# Altium schematic sheet 780-00055, rev2, Pg1, SCH, NRES Temp Meas, 8-Chan RTD .SchDoc
size B; PageSetup: Record=PageOptions|CenterHorizontal=True|CenterVertical=True|PrintScale=1.00|XCorrection=1.00|YCorrection=1.00|PrintKind=0|BorderSize=5000000|LeftOffset=0|BottomOffset=0|Orientation=2|PaperLength=4318|PaperWidth=2794|Scale=100|PaperSource=7|PrintQuality=600|MediaType=257|DitherType=256|PrintScaleMode=0|PaperKind=Ledger|PaperIndex=3
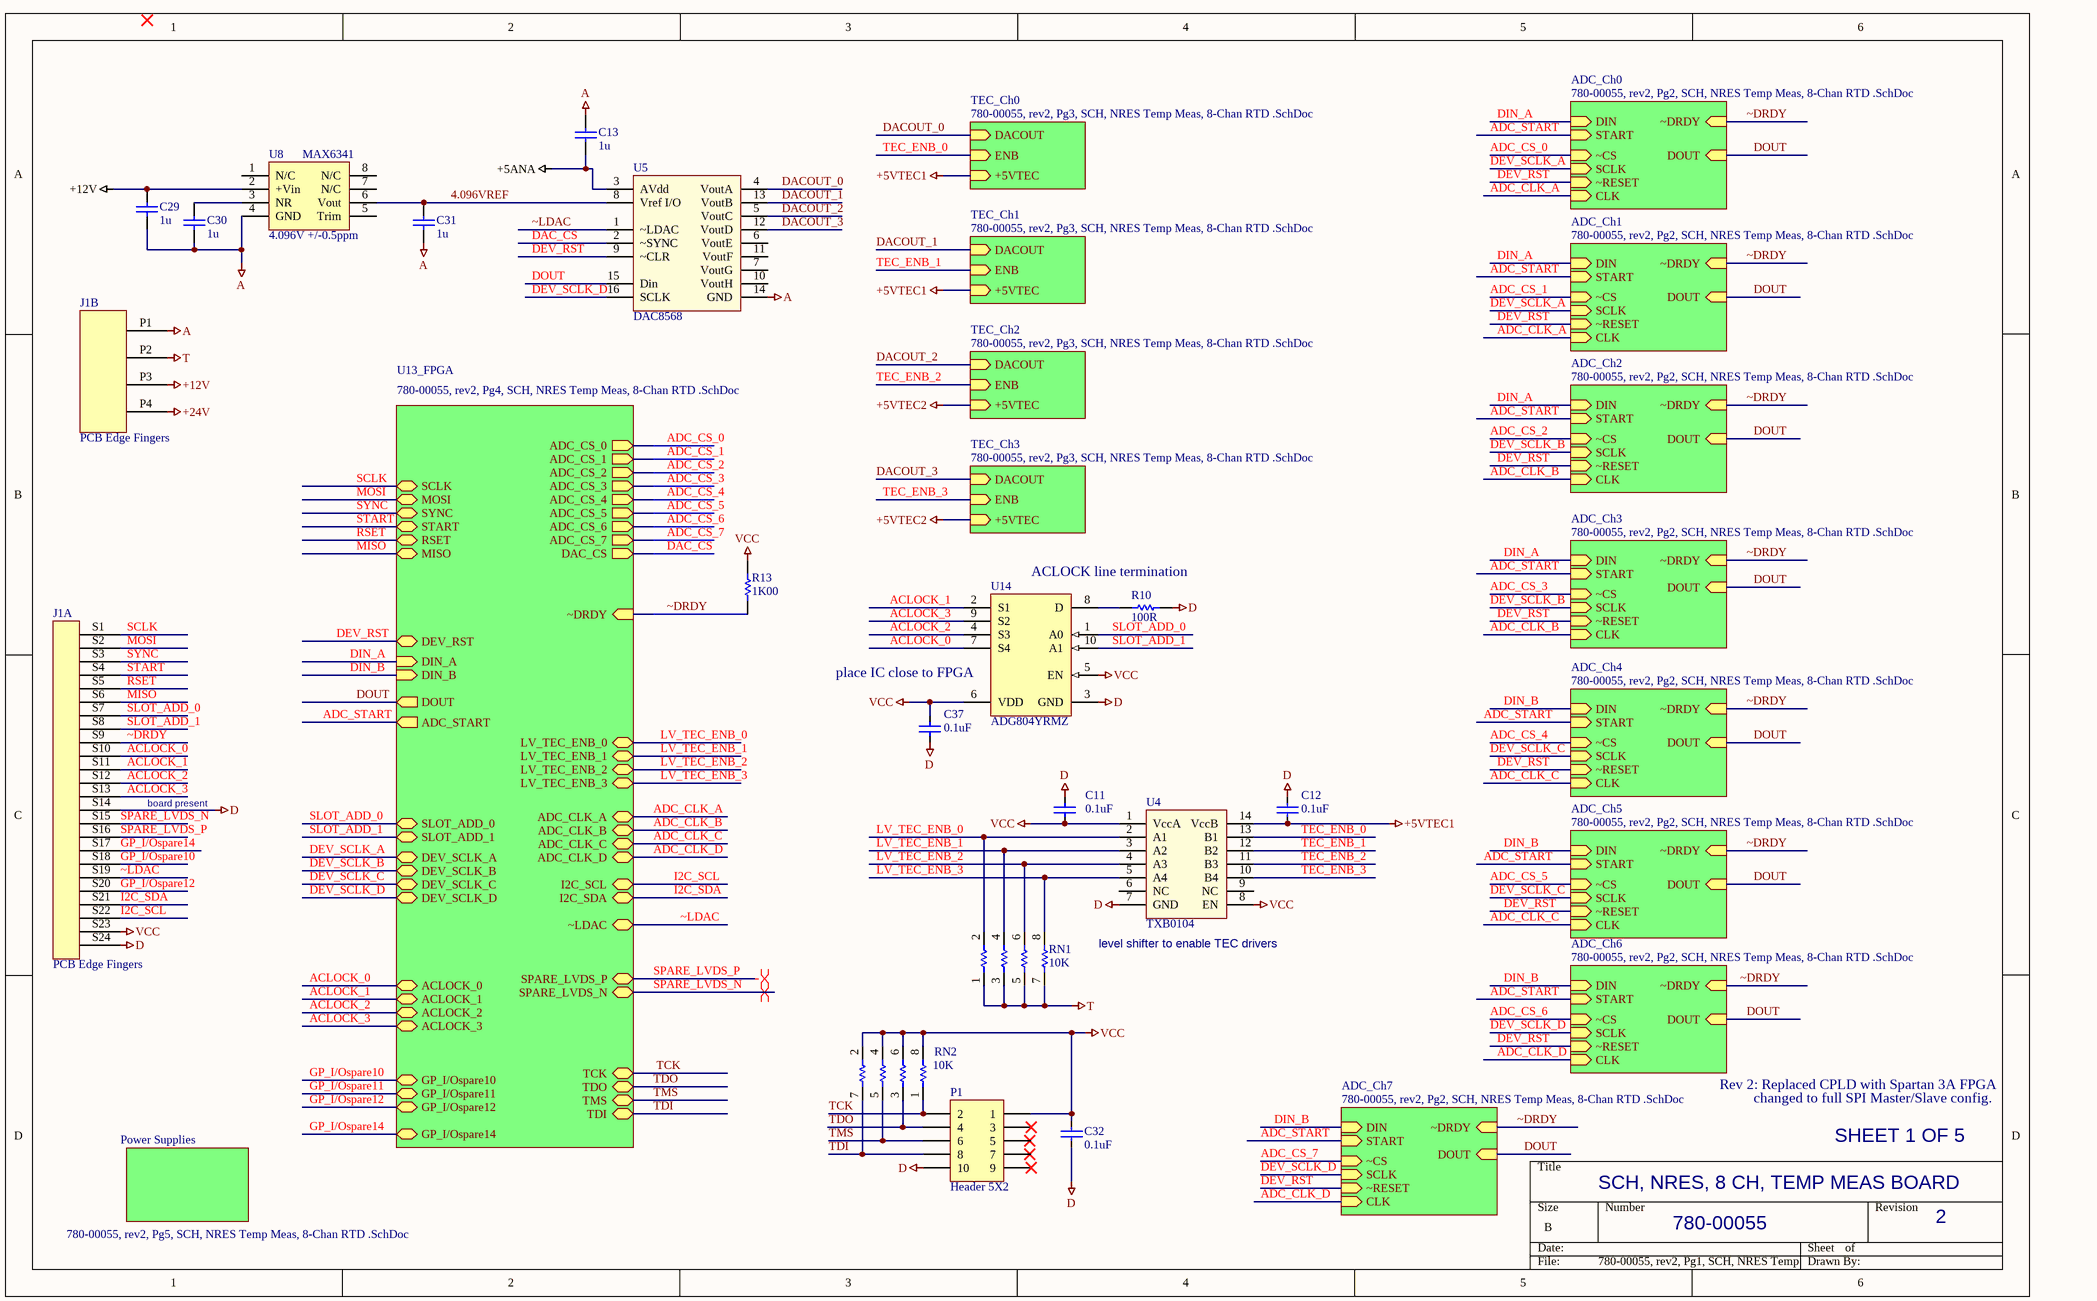
[diagram p0: 780-00055, rev2, Pg1, SCH, NRES Temp Meas, 8-Chan RTD .SchDoc]

## Parts
C11  value 0.1uF  [SMD_0805]  (hidden comment: Cap SMD)
C12  value 0.1uF  [SMD_0805]  (hidden comment: Cap SMD)
C13  1u  [SMD_0805]
C29  1u  [SMD_0805]
C30  1u  [SMD_0805]
C31  1u  [SMD_0805]
C32  value 0.1uF  [SMD_0805]  (hidden comment: Cap SMD)
C37  value 0.1uF  [SMD_0805]  (hidden comment: Cap SMD)
J1  PCB Edge Fingers  [PCB EDGE, MOLEX 46114]  (parts A,B of 2)
P1  Header 5X2  [HDR 2x5 RT, SAMTEC TSW]
R10  value 100R  [SMD_0805]  (hidden comment: Res 0805)
R13  value 1K00  [SMD_0805]  (hidden comment: Res 0805)
RN1  value 10K  [RES ARRAY 0603 x 4]  (hidden comment: RES ARRAY  x4 10K)
RN2  value 10K  [RES ARRAY 0603 x 4]  (hidden comment: RES ARRAY  x4)
U4  TXB0104  [TSSOP14]
U5  DAC8568  [TSSOP16]
U8  4.096V +/-0.5ppm  value MAX6341  [SO-8_M]
U14  ADG804YRMZ  [ADI-RM-10_L]

## Sub-sheets
ADC_Ch0 = 780-00055, rev2, Pg2, SCH, NRES Temp Meas, 8-Chan RTD .SchDoc: SCLK (in), ~RESET (in), DIN (in), ~DRDY (in), DOUT (in), ~CS (in), START (in), CLK (in)
ADC_Ch1 = 780-00055, rev2, Pg2, SCH, NRES Temp Meas, 8-Chan RTD .SchDoc: SCLK (in), ~RESET (in), DIN (in), ~DRDY (in), ~CS (in), DOUT (in), START (in), CLK (in)
ADC_Ch2 = 780-00055, rev2, Pg2, SCH, NRES Temp Meas, 8-Chan RTD .SchDoc: SCLK (in), ~RESET (in), DIN (in), ~DRDY (in), ~CS (in), DOUT (in), START (in), CLK (in)
ADC_Ch3 = 780-00055, rev2, Pg2, SCH, NRES Temp Meas, 8-Chan RTD .SchDoc: SCLK (in), ~RESET (in), DIN (in), ~DRDY (in), ~CS (in), DOUT (in), START (in), CLK (in)
ADC_Ch4 = 780-00055, rev2, Pg2, SCH, NRES Temp Meas, 8-Chan RTD .SchDoc: SCLK (in), ~RESET (in), DIN (in), ~DRDY (in), ~CS (in), DOUT (in), START (in), CLK (in)
ADC_Ch5 = 780-00055, rev2, Pg2, SCH, NRES Temp Meas, 8-Chan RTD .SchDoc: SCLK (in), ~RESET (in), DIN (in), ~DRDY (in), ~CS (in), DOUT (in), START (in), CLK (in)
ADC_Ch6 = 780-00055, rev2, Pg2, SCH, NRES Temp Meas, 8-Chan RTD .SchDoc: SCLK (in), ~RESET (in), DIN (in), ~DRDY (in), ~CS (in), DOUT (in), START (in), CLK (in)
ADC_Ch7 = 780-00055, rev2, Pg2, SCH, NRES Temp Meas, 8-Chan RTD .SchDoc: SCLK (in), ~RESET (in), DIN (in), ~DRDY (in), ~CS (in), DOUT (in), START (in), CLK (in)
Power Supplies = 780-00055, rev2, Pg5, SCH, NRES Temp Meas, 8-Chan RTD .SchDoc: no entries
TEC_Ch0 = 780-00055, rev2, Pg3, SCH, NRES Temp Meas, 8-Chan RTD .SchDoc: DACOUT (in), +5VTEC (in), ENB (in)
TEC_Ch1 = 780-00055, rev2, Pg3, SCH, NRES Temp Meas, 8-Chan RTD .SchDoc: DACOUT (in), +5VTEC (in), ENB (in)
TEC_Ch2 = 780-00055, rev2, Pg3, SCH, NRES Temp Meas, 8-Chan RTD .SchDoc: DACOUT (in), +5VTEC (in), ENB (in)
TEC_Ch3 = 780-00055, rev2, Pg3, SCH, NRES Temp Meas, 8-Chan RTD .SchDoc: DACOUT (in), +5VTEC (in), ENB (in)
U13_FPGA = 780-00055, rev2, Pg4, SCH, NRES Temp Meas, 8-Chan RTD .SchDoc: ADC_CS_0 (out), ADC_CS_1 (out), ADC_CS_2 (out), ADC_CS_3 (out), ADC_CS_4 (out), ADC_CS_5 (out), ADC_CS_6 (out), ADC_CS_7 (out), DAC_CS (out), ADC_START (out), SCLK, MOSI, SYNC, START, RSET, MISO, SLOT_ADD_0, SLOT_ADD_1, DEV_SCLK_A, DEV_SCLK_B, DEV_SCLK_C, DEV_SCLK_D, DEV_RST, DIN_A (in), DIN_B (in), I2C_SCL, I2C_SDA, ~LDAC, GP_I/Ospare10, GP_I/Ospare11, GP_I/Ospare12, GP_I/Ospare14, ~DRDY (in), DOUT (out), ACLOCK_0, ACLOCK_1, ACLOCK_2, ACLOCK_3, ADC_CLK_A, ADC_CLK_B, ADC_CLK_C, ADC_CLK_D, LV_TEC_ENB_0, LV_TEC_ENB_1, LV_TEC_ENB_2, LV_TEC_ENB_3, TDI, TDO, TCK, TMS, SPARE_LVDS_P, SPARE_LVDS_N

## Nets
+5ANA: C13.2 U5.3(AVdd)
+5VTEC1: C12.1 U4.14(VccB) ; sheet TEC_Ch0/+5VTEC, sheet TEC_Ch1/+5VTEC
+5VTEC2: sheet TEC_Ch2/+5VTEC, sheet TEC_Ch3/+5VTEC
+12V: C29.1 J1.P3(S27) U8.2(+Vin)
+24V: J1.P4(S28)
A: C13.1 C29.2 C30.2 C31.2 J1.P1(S25) U5.14(GND) U8.4(GND)
D: C11.2 C12.2 C32.1 C37.1 J1.S14 J1.S24 P1.10 R10.2 U4.7(GND) U14.3(GND)
T: J1.P2(S26) RN1.1 RN1.3 RN1.5 RN1.7
VCC: C11.1 C32.2 C37.2 J1.S23 P1.1 R13.2 RN2.2 RN2.4 RN2.6 RN2.8 U4.1(VccA) U4.8(EN) U14.5(EN) U14.6(VDD)
4.096VREF: C31.1 U5.8(Vref_I/O) U8.6(Vout)
ACLOCK_0: J1.S10 U14.7(S4) ; sheet U13_FPGA/ACLOCK_0
ACLOCK_1: J1.S11 U14.2(S1) ; sheet U13_FPGA/ACLOCK_1
ACLOCK_2: J1.S12 U14.4(S3) ; sheet U13_FPGA/ACLOCK_2
ACLOCK_3: J1.S13 U14.9(S2) ; sheet U13_FPGA/ACLOCK_3
ADC_CLK_A: sheet ADC_Ch0/CLK, sheet ADC_Ch1/CLK, sheet U13_FPGA/ADC_CLK_A
ADC_CLK_B: sheet ADC_Ch3/CLK, sheet ADC_Ch2/CLK, sheet U13_FPGA/ADC_CLK_B
ADC_CLK_C: sheet ADC_Ch4/CLK, sheet ADC_Ch5/CLK, sheet U13_FPGA/ADC_CLK_C
ADC_CLK_D: sheet ADC_Ch6/CLK, sheet ADC_Ch7/CLK, sheet U13_FPGA/ADC_CLK_D
ADC_CS_0: sheet ADC_Ch0/~CS, sheet U13_FPGA/ADC_CS_0
ADC_CS_1: sheet ADC_Ch1/~CS, sheet U13_FPGA/ADC_CS_1
ADC_CS_2: sheet ADC_Ch2/~CS, sheet U13_FPGA/ADC_CS_2
ADC_CS_3: sheet ADC_Ch3/~CS, sheet U13_FPGA/ADC_CS_3
ADC_CS_4: sheet ADC_Ch4/~CS, sheet U13_FPGA/ADC_CS_4
ADC_CS_5: sheet ADC_Ch5/~CS, sheet U13_FPGA/ADC_CS_5
ADC_CS_6: sheet ADC_Ch6/~CS, sheet U13_FPGA/ADC_CS_6
ADC_CS_7: sheet ADC_Ch7/~CS, sheet U13_FPGA/ADC_CS_7
ADC_START: sheet ADC_Ch3/START, sheet ADC_Ch4/START, sheet ADC_Ch5/START, sheet ADC_Ch6/START, sheet ADC_Ch7/START, sheet ADC_Ch0/START, sheet ADC_Ch1/START, sheet ADC_Ch2/START, sheet U13_FPGA/ADC_START
DAC_CS: U5.2(~SYNC) ; sheet U13_FPGA/DAC_CS
DACOUT_0: U5.4(VoutA) ; sheet TEC_Ch0/DACOUT
DACOUT_1: U5.13(VoutB) ; sheet TEC_Ch1/DACOUT
DACOUT_2: U5.5(VoutC) ; sheet TEC_Ch2/DACOUT
DACOUT_3: U5.12(VoutD) ; sheet TEC_Ch3/DACOUT
DEV_RST: U5.9(~CLR) ; sheet ADC_Ch3/~RESET, sheet ADC_Ch4/~RESET, sheet ADC_Ch5/~RESET, sheet ADC_Ch6/~RESET, sheet ADC_Ch7/~RESET, sheet ADC_Ch0/~RESET, sheet ADC_Ch1/~RESET, sheet ADC_Ch2/~RESET, sheet U13_FPGA/DEV_RST
DEV_SCLK_A: sheet ADC_Ch0/SCLK, sheet ADC_Ch1/SCLK, sheet U13_FPGA/DEV_SCLK_A
DEV_SCLK_B: sheet ADC_Ch3/SCLK, sheet ADC_Ch2/SCLK, sheet U13_FPGA/DEV_SCLK_B
DEV_SCLK_C: sheet ADC_Ch4/SCLK, sheet ADC_Ch5/SCLK, sheet U13_FPGA/DEV_SCLK_C
DEV_SCLK_D: U5.16(SCLK) ; sheet ADC_Ch6/SCLK, sheet ADC_Ch7/SCLK, sheet U13_FPGA/DEV_SCLK_D
DIN_A: sheet ADC_Ch3/DIN, sheet ADC_Ch0/DIN, sheet ADC_Ch1/DIN, sheet ADC_Ch2/DIN, sheet U13_FPGA/DIN_A
DIN_B: sheet ADC_Ch4/DIN, sheet ADC_Ch5/DIN, sheet ADC_Ch6/DIN, sheet ADC_Ch7/DIN, sheet U13_FPGA/DIN_B
DOUT: U5.15(Din) ; sheet ADC_Ch3/DOUT, sheet ADC_Ch4/DOUT, sheet ADC_Ch5/DOUT, sheet ADC_Ch6/DOUT, sheet ADC_Ch7/DOUT, sheet ADC_Ch0/DOUT, sheet ADC_Ch1/DOUT, sheet ADC_Ch2/DOUT, sheet U13_FPGA/DOUT
GP_I/Ospare10: J1.S18 ; sheet U13_FPGA/GP_I/Ospare10
GP_I/Ospare11: sheet U13_FPGA/GP_I/Ospare11
GP_I/Ospare12: J1.S20 ; sheet U13_FPGA/GP_I/Ospare12
GP_I/Ospare14: J1.S17 ; sheet U13_FPGA/GP_I/Ospare14
I2C_SCL: J1.S22 ; sheet U13_FPGA/I2C_SCL
I2C_SDA: J1.S21 ; sheet U13_FPGA/I2C_SDA
LV_TEC_ENB_0: RN1.2 U4.2(A1) ; sheet U13_FPGA/LV_TEC_ENB_0
LV_TEC_ENB_1: RN1.4 U4.3(A2) ; sheet U13_FPGA/LV_TEC_ENB_1
LV_TEC_ENB_2: RN1.6 U4.4(A3) ; sheet U13_FPGA/LV_TEC_ENB_2
LV_TEC_ENB_3: RN1.8 U4.5(A4) ; sheet U13_FPGA/LV_TEC_ENB_3
MISO: J1.S6 ; sheet U13_FPGA/MISO
MOSI: J1.S2 ; sheet U13_FPGA/MOSI
RSET: J1.S5 ; sheet U13_FPGA/RSET
SCLK: J1.S1 ; sheet U13_FPGA/SCLK
SLOT_ADD_0: J1.S7 U14.1(A0) ; sheet U13_FPGA/SLOT_ADD_0
SLOT_ADD_1: J1.S8 U14.10(A1) ; sheet U13_FPGA/SLOT_ADD_1
SPARE_LVDS_N: J1.S15 ; sheet U13_FPGA/SPARE_LVDS_N
SPARE_LVDS_P: J1.S16 ; sheet U13_FPGA/SPARE_LVDS_P
START: J1.S4 ; sheet U13_FPGA/START
SYNC: J1.S3 ; sheet U13_FPGA/SYNC
TCK: P1.2 RN2.1 ; sheet U13_FPGA/TCK
TDI: P1.8 RN2.7 ; sheet U13_FPGA/TDI
TDO: P1.4 RN2.3 ; sheet U13_FPGA/TDO
TEC_ENB_0: U4.13(B1) ; sheet TEC_Ch0/ENB
TEC_ENB_1: U4.12(B2) ; sheet TEC_Ch1/ENB
TEC_ENB_2: U4.11(B3) ; sheet TEC_Ch2/ENB
TEC_ENB_3: U4.10(B4) ; sheet TEC_Ch3/ENB
TMS: P1.6 RN2.5 ; sheet U13_FPGA/TMS
~DRDY: J1.S9 R13.1 ; sheet ADC_Ch3/~DRDY, sheet ADC_Ch4/~DRDY, sheet ADC_Ch5/~DRDY, sheet ADC_Ch6/~DRDY, sheet ADC_Ch7/~DRDY, sheet ADC_Ch0/~DRDY, sheet ADC_Ch1/~DRDY, sheet ADC_Ch2/~DRDY, sheet U13_FPGA/~DRDY
~LDAC: J1.S19 U5.1(~LDAC) ; sheet U13_FPGA/~LDAC
NetC30_1: C30.1 U8.3(NR)
NetR10_1: R10.1 U14.8(D)

Not connected (* = marked no-connect by the designer): P1 3* 5 7 9*; U4 6(NC) 9(NC); U5 6(VoutE) 7(VoutG) 10(VoutH) 11(VoutF); U8 1(N/C) 5(Trim) 7(N/C) 8(N/C)

## Layout directives
differential pair: SPARE_LVDS_N, SPARE_LVDS_P

## Notes on the sheet
- ACLOCK line termination
- (near U14) place IC close to FPGA
- board present
- level shifter to enable TEC drivers
- Rev 2: Replaced CPLD with Spartan 3A FPGA
- changed to full SPI Master/Slave config.
- SCH, NRES, 8 CH, TEMP MEAS BOARD
- SHEET 1 OF 5
- 780-00055
- 2

## Library data of the parts
C11 C12 C37 = Cap SMD: Capacitor; LCO p/n: 120-00002
C13 C29-C31 = Cap: Capacitor; Manufacturer: Taiyo Yuden; Manuf p/n: UMK212F105ZG-T; Vendor: DIGIKEY; Vendor Mult.: 10; Vendor p/n: 587-1308-1-ND; LCO p/n: 120-00027; Value: 1u; COST: 0.088
C32 = Cap SMD: Capacitor; Manufacturer: AVX; Manuf p/n: 08055C104KAT2A; Vendor: DigiKey; Vendor p/n: 478-1395-1-ND; Vendor Mult.: 10; LCO P/N: 120-00002; COST: 0.088
J1 = Conn, PCB Card Edge / Molex 46114, 24 sig / 4 pwr: PCB Edge Conn to fit Molex 46114 backplane connector
P1 = Header 5X2: Header, 5-Pin, Dual row; Manufacturer: FCI; Vendor: DigiKey; Vendor Mult.: 1; LCO P/N: 125-00396; COST: 0.81; Value: Header 5X2
R10 = Res SMD: Resistor 0805; Manufacturer: Vishay/Dale; Manuf p/n: CRCW0805100RFKEA; Vendor: DIGIKEY; Vendor p/n: 541-100RCCT-ND; Vendor Mult.: 10; LCO p/n: 181-01000; COST: 0.09
R13 = Res SMD: Resistor 0805; Manufacturer: Vishay/Dale; Manuf p/n: CRCW08051K00FKEA; Vendor: DIGIKEY; Vendor p/n: 541-1K00CCT-ND; Vendor Mult.: 10; LCO p/n: 181-01001; COST: 0.09
RN1 = RES ARRAY  x4 10K: Resistor Array 4 Isolated; Manufacturer: PANASONIC - ECG; Manuf p/n: EXB-38V103JV; Vendor: DIGIKEY; Vendor p/n: Y9103CT-ND; Vendor Mult.: 10; LCO p/n: 180-00043; COST: 0.03
RN2 = RES ARRAY  x4: Resistor Array 4 Isolated; Manufacturer: Panasonic ECG; Manuf p/n: EXB-38V103JV; Vendor: DigiKey; Vendor p/n: Y9103CT-ND; Vendor Mult.: 10; LCO P/N: 180-00043; COST: 0.031
U4 = TXB0104: 4-Chan Logic Level Shifter Bi-directional; Manufacturer: TI; Manuf p/n: TXB0104PWR; LCO p/n: 150-00108; Vendor: DK; Vendor p/n: 296-21929-1-ND; VALUE: TXB0104
U5 = DAC8568: 8 Chan, 16-bit DAC, SPI Interface; Manufacturer: TI; Manuf p/n: DAC8568IAPW; LCO p/n: 150-00107; Vendor: DK; Vendor p/n: 296-24444-5-ND; VALUE: DAC8568
U8 = MAX6341: VREF 4.096V 0.5ppm; Manufacturer: MAXIM; Manuf p/n: MAX6341CSA+; Vendor: DIGIKEY; Vendor p/n: MAX6341CSA+-ND; Vendor Mult.: 1; LCO p/n: 150-00052; COST: 17.76
U14 = CMP-0798-00106-1: 1.65 to 3.6 V, CMOS, 0.5 Ohm, 4-Channel Multiplexer, -40 to 125 degC, 10-pin SOP (RM-10), Tube; Manufacturer: Analog Devices; Supply V Guar Performance: Single_(+2.5V), Single_(+3.3V), Single_(+3V); Bandwidth (Hz): 33M; Ron (ohms): 500; Max Analog Signal Range: 0 to Vdd; t transition (s): 24n; LCO p/n: 150-00116; ComponentLink2URL: http://www.analog.com/static/imported-files/data_sheets/ADG804.pdf; PackageDescription: 10-Pin Mini Small Outline Package, Body 3 x 3 mm, Pitch 0.5 mm; PackageVersion: Aug-05; Mounting Technology: Surface Mount; PackageReference: RM-10; Code_JEDEC: MO-187-BA; DatasheetVersion: Rev. A; Packing: Tube; ComponentLink3URL: http://www.analog.com/static/imported-files/packages/PKG_PDF/MSOP%28RM%29/RM_10.pdf; ComponentLink1Description: Manufacturer URL; ComponentLink2Description: Datasheet; ComponentLink3Description: Package Specification; PartNumber: ADG804YRMZ; ComponentLink1URL: http://www.analog.com/en/index.html